# EasyEDA Pro project NU1680无线充电接收端底座.eprj, schematic 普通
Create Date: 2024-03-03; Page Name: P1; Project Name: NU1680无线充电接收端底座; Schematic Name: 普通; Update Date: 2024-03-03; Company: 嘉立创EDA; Page Size: A4; Version: V1.0
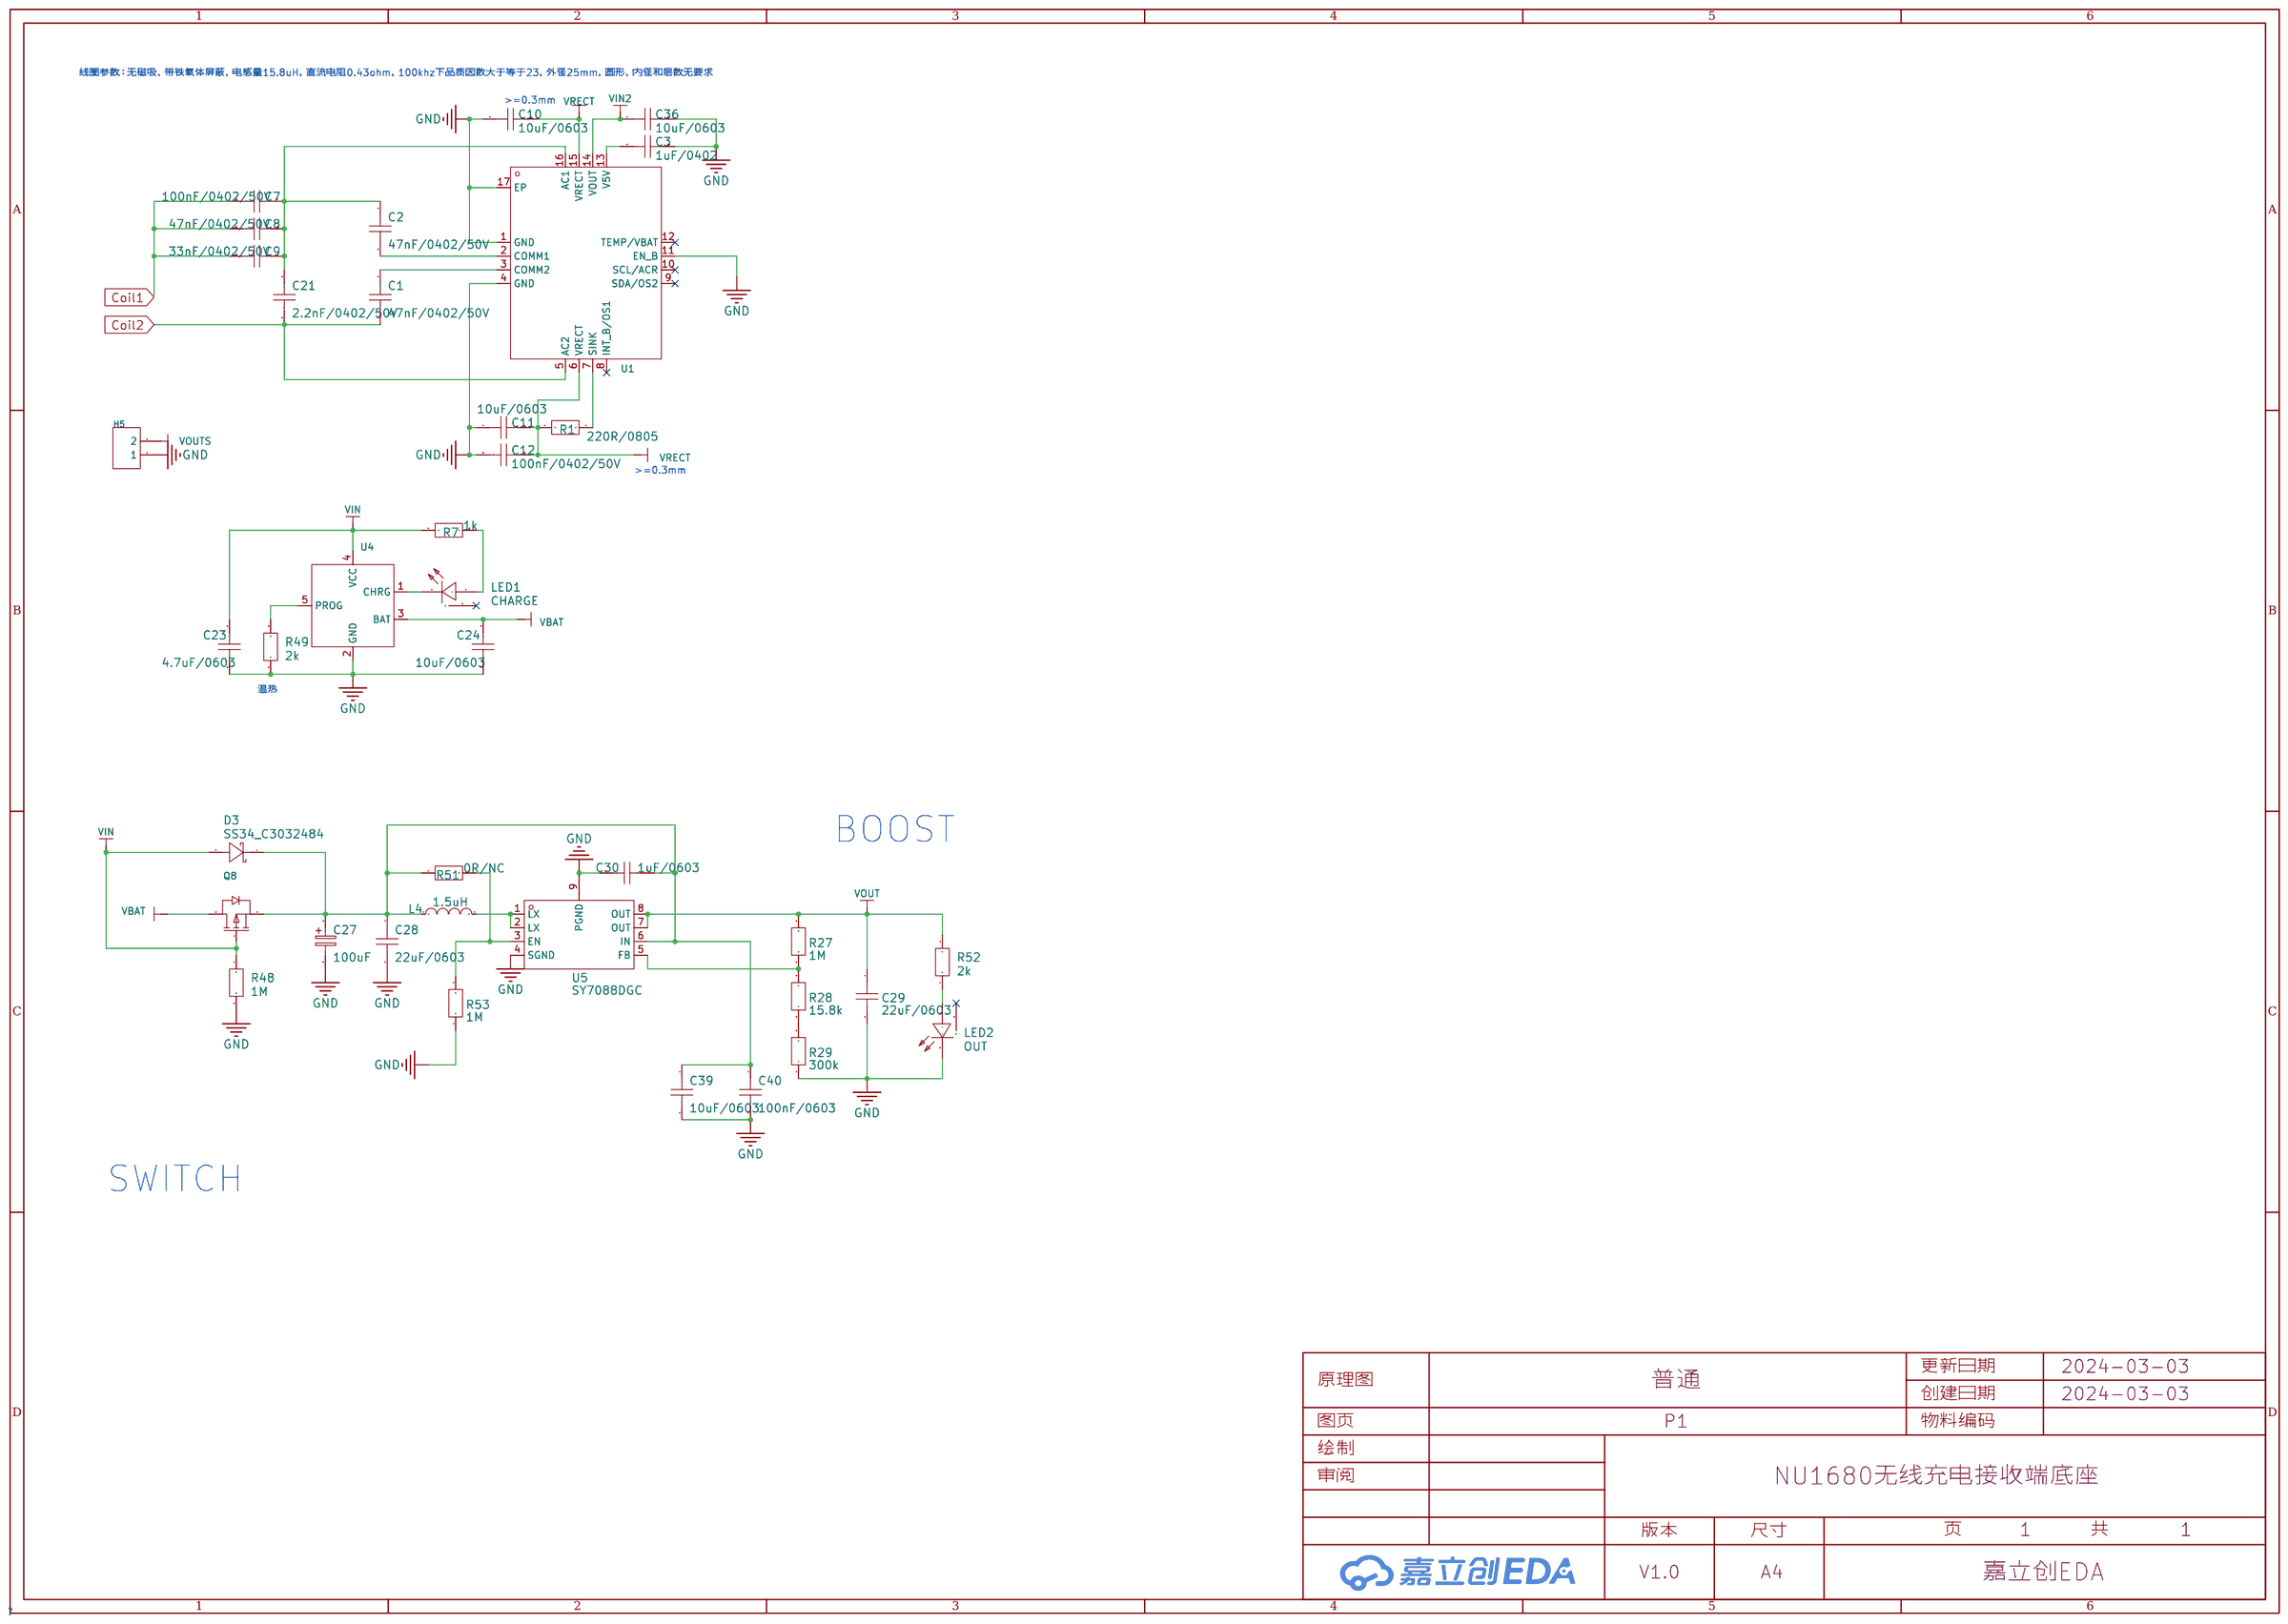
[diagram p1: schematic sheet]

## Parts
C1  47nF/0402/50V  [C0402]
C2  47nF/0402/50V  [C0402]
C3  1uF/0402  [C0402]
C7  100nF/0402/50V  [C0402]
C8  47nF/0402/50V  [C0402]
C9  33nF/0402/50V  [C0402]
C10  10uF/0603  [C0603]
C11  10uF/0603  [C0603]
C12  100nF/0402/50V  [C0402]
C21  2.2nF/0402/50V  [C0402]
C23  4.7uF/0603  [C0603]
C24  10uF/0603  [C0603]
C27  100uF  [CAP-SMD_L3.5-W2.8]
C28  22uF/0603  [C0603]
C29  22uF/0603  [C0603]
C30  1uF/0603  [C0603]
C36  10uF/0603  [C0603]
C39  10uF/0603  [C0603]
C40  100nF/0603  [C0603]
D3  SS34_C3032484  [SMA_L4.3-W2.6-LS5.2-RD]
H5  -  [HDR-TH_2P-P2.54-V-F]  (no BOM)
L4  1.5uH  [IND-SMD_L2.5-W2.0_MHCD252012A]
LED1  CHARGE  [LED-SMD_L3.2-W1.0-R-RD]
LED2  OUT  [LED-SMD_L3.2-W1.0-R-RD]
Q8  DMG2305UX-7  [SOT-23-3_L2.9-W1.3-P1.90-LS2.4-BR]
R1  220R/0805  [R0805]
R7  1k  [R0603]
R27  1M  [R0603]
R28  15.8k  [R0603]
R29  300k  [R0603]
R48  1M  [R0603]
R49  2k  [R0603]
R51  0R/NC  [R0402]
R52  2k  [R0603]
R53  1M  [R0603]
U1  NU1680  [QFN-16_L3.0-W3.0-P0.50-TL-EP1.9]
U4  TP4054  [TSOT-23-5_L2.9-W1.6-P0.95-LS2.8-BR]
U5  SY7088DGC  [DFN-8_L3.0-W2.0-P0.50-BL-EP]

## Library data of the parts
C1-C3 C7-C12 C21 C23 C24 C36 C39 C40 = 10uF
C27 = F931A107KBAAHA: Supplier: LCSC; Supplier Part: C304232; Manufacturer: Kyocera AVX; JLCPCB Part Class: Extended Part
C28 C29 = 22uF
C30 = 1uF
D3 = SS34: Supplier: LCSC; Supplier Part: C3032484; Manufacturer: TDD(台冠电子); JLCPCB Part Class: Extended Part
H5 = HDR-F_2.54_1x2P: Supplier Part: C49661; Supplier Footprint: 插件
L4 = MHCD252012A-1R5M-A8S: Supplier: LCSC; Supplier Part: C285767; Manufacturer: chilisin(奇力新); JLCPCB Part Class: Extended Part
LED1 LED2 = E6C1204QBAC1UDA: Supplier: LCSC; Supplier Part: C375481; Manufacturer: EKINGLUX; JLCPCB Part Class: Extended Part
Q8 = DMG2305UX-7: 类型:P沟道;漏源电压(Vdss):20V;连续漏极电流(Id):4.2A;功率(Pd):1.4W;导通电阻(RDS(on)@Vgs,Id):52mΩ@4.5V,4.2A;; LCSC Part Name: P沟道 20V 4.2A; Supplier Part: C150470; Manufacturer: DIODES(美台); Supplier Footprint: SOT-23; Datasheet: https://atta.szlcsc.com/upload/public/pdf/source/20171221/C150470_15138312285201195465.pdf; Supplier: LCSC; Type: P沟道; Drain Source Voltage (Vdss): 20V; Continuous Drain Current (Id): 4.2A; Power Dissipation (Pd): 1.4W; Drain Source On Resistance (RDS(on)@Vgs,Id): 52mΩ@4.5V,4.2A; Gate Threshold Voltage (Vgs(th)@Id): 900mV@250uA; Total Gate Charge (Qg@Vgs): 10.2nC@4.5V; Input Capacitance (Ciss@Vds): 808pF@15V; Operating Temperature: -55℃~+150℃@(Tj)
R1 R7 R49 R51 R52 = 4.7k
R27 R48 R53 = 1M
R28 = 15.8k
R29 = 300k
U1 = NU1680: Supplier Part: C9900015597; Supplier Footprint: QFN-16; JLCPCB Part Class: 扩展库; Datasheet: https://atta.szlcsc.comnull; Supplier: LCSC
U4 = TP4054_C668215: 电源电压:6.5V;最大充电电流:500mA;电池类型:锂离子/聚合物;电池节数:1;; Supplier: LCSC; Supplier Part: C668215; Manufacturer: UMW(友台半导体); Supplier Footprint: SOT-23-5L; Datasheet: https://atta.szlcsc.com/upload/public/pdf/source/20231109/1E60770826C4E1A0E5898BBC08FF3A57.pdf; Supply Voltage: 6.5V; Maximum Charge Current: 500mA; Type of Battery: 锂离子/聚合物; Number of Cells: 1; Operating Temperature: -40℃~+85℃
U5 = SY7088DGC: Supplier: LCSC; Supplier Part: C178240; Manufacturer: silergy(矽力杰); JLCPCB Part Class: Extended Part

## Nets
GND: C3.1 C10.1 C11.1 C12.2 C23.1 C24.1 C27.2 C28.2 C29.2 C30.1 C36.2 C39.2 C40.2 H5.1 LED2.2(-) R29.1 R48.2 R49.1 R53.1 U1.1(GND) U1.4(GND) U1.11(EN_B) U1.17(EP) U4.2(GND) U5.4(SGND) U5.9(PGND)
VBAT: C24.2 Q8.3(D) U4.3(BAT)
VIN: C23.2 D3.2(A) Q8.1(G) R7.1 R48.1 U4.4(VCC)
VIN2: C36.1 U1.14(VOUT)
Coil1: C7.2 C8.2 C9.2
Coil2: C1.2 C21.2 U1.5(AC2)
VOUT: C29.1 R27.2 R52.2 U5.7(OUT) U5.8(OUT)
VOUTS: H5.2
VRECT: C10.2 C11.2 C12.1 R1.2 U1.6(VRECT) U1.15(VRECT)
$1N670: C2.2 U1.2(COMM1)
$1N673: C1.1 U1.3(COMM2)
$1N854: C2.1 C7.1 C8.1 C9.1 C21.1 U1.16(AC1)
$1N972: C3.2 U1.13(V5V)
$1N1319: R1.1 U1.7(SINK)
$1N2387: R49.2 U4.5(PROG)
$1N2482: LED1.1(+) R7.2
$1N2485: LED1.2(-) U4.1(CHRG)
$1N2905: L4.2 U5.1(LX) U5.2(LX)
$1N2909: R27.1 R28.2 U5.5(FB)
$1N2915: R28.1 R29.2
$1N13189: LED2.1(+) R52.1
Net-(C27-1): C27.1 C28.1 C30.2 C39.1 C40.1 D3.1(K) L4.1 Q8.2(S) R51.1 U5.6(IN)
Net-(R51-2): R51.2 R53.2 U5.3(EN)

Not connected (* = marked no-connect by the designer): LED1 3*; LED2 3*; U1 8(INT_B/OS1)* 9(SDA/OS2)* 10(SCL/ACR)* 12(TEMP/VBAT)*

## Notes on the sheet
- 线圈参数：无磁吸，带铁氧体屏蔽，电感量15.8uH，直流电阻0.43ohm，100khz下品质因数大于等于23，外径25mm，圆形，内径和层数无要求
- >=0.3mm
- >=0.3mm
- 温热
- BOOST
- SWITCH
